# EAGLE design AudioUSB (EAGLE 9.4.0)
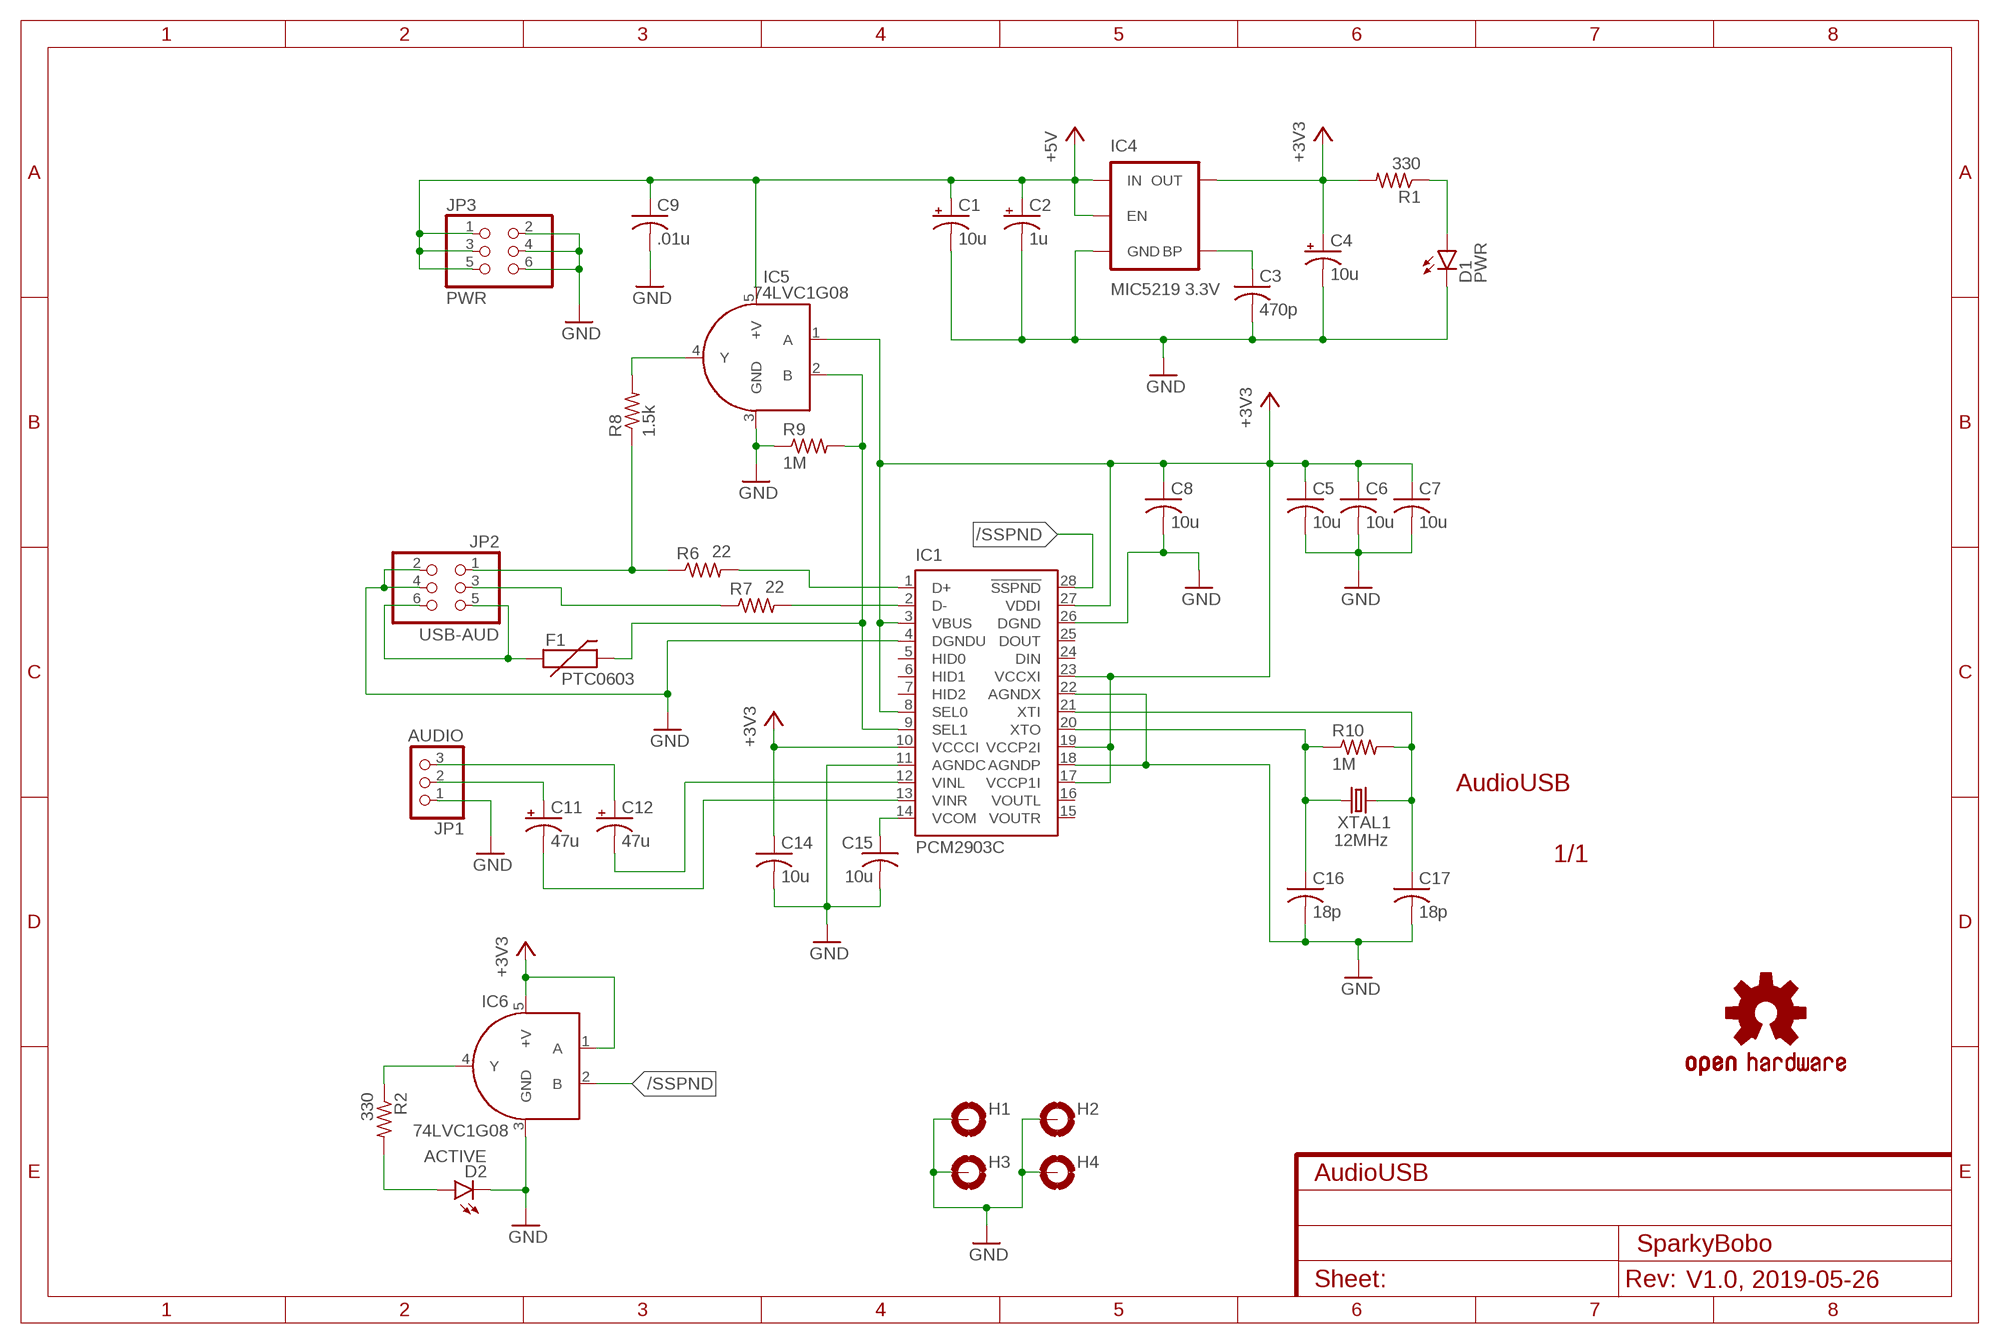
[diagram p0: schematic, sheet 1]
FRAME1 (FRAME-A4L): CNAME: AudioUSB; CREVISION: V1.0, 2019-05-26; DESIGNER: SparkyBobo

## Parts
C1  10u  CPOL-USB  [PANASONIC_B]
C2  1u  CPOL-USB  [PANASONIC_B]
C3  470p  C-USC0603  [C0603]
C4  10u  CPOL-USB  [PANASONIC_B]
C5  10u  C-USC0603  [C0603]
C6  10u  C-USC0603  [C0603]
C7  10u  C-USC0603  [C0603]
C8  10u  C-USC0603  [C0603]
C9  .01u  C-USC0603  [C0603]
C11  47u  CPOL-USD  [PANASONIC_D]
C12  47u  CPOL-USD  [PANASONIC_D]
C14  10u  C-USC0603  [C0603]
C15  10u  C-USC0603  [C0603]
C16  18p  C-USC0603  [C0603]
C17  18p  C-USC0603  [C0603]
D1  PWR  LED0603  [LED-0603]
D2  ACTIVE  LED0603  [LED-0603]
F1  PTC0603  [0603]
H1  MOUNT-PAD-ROUND2.8  [2,8-PAD]
H2  MOUNT-PAD-ROUND2.8  [2,8-PAD]
H3  MOUNT-PAD-ROUND2.8  [2,8-PAD]
H4  MOUNT-PAD-ROUND2.8  [2,8-PAD]
IC1  PCM2903C  [SSOP28]
IC4  MIC5219 3.3V  V_REG_MIC52193.3V  [SOT23-5]
IC5  74LVC1G08  SN74LVC1G08  [SOT23-5]
IC6  74LVC1G08  SN74LVC1G08  [SOT23-5]
JP1  AUDIO  PINHD-1X3  [1X03]
JP2  USB-AUD  PINHD-2X3  [2X03]
JP3  PWR  PINHD-2X3  [2X03]
LOGO1  OSHW-LOGOS  [OSHW-LOGO-S]
R1  330  R-US_R0603  [R0603]
R2  330  R-US_R0603  [R0603]
R6  22  R-US_R0603  [R0603]
R7  22  R-US_R0603  [R0603]
R8  1.5k  R-US_R0603  [R0603]
R9  1M  R-US_R0603  [R0603]
R10  1M  R-US_R0603  [R0603]
XTAL1  12MHz  CRYSTALHC49US  [HC49US]

## Nets
+3V3: C4.+ C5.1 C6.1 C7.1 C8.1 C14.1 IC1.3(VBUS) IC1.8(SEL0) IC1.10(VCCCI) IC1.17(VCCP1I) IC1.19(VCCP2I) IC1.23(VCCXI) IC1.27(VDDI) IC4.5(OUT) IC5.1(A) IC6.1(A) IC6.5(+V) R1.2
+5V: C1.+ C2.+ C9.1 IC4.1(IN) IC4.3(EN) IC5.5(+V) JP3.1 JP3.3 JP3.5
/SSPND: IC1.28(!SSPND) IC6.2(B)
GND: C1.- C2.- C3.2 C4.- C5.2 C6.2 C7.2 C8.2 C9.2 C14.2 C15.2 C16.2 C17.2 D1.C D2.C H1.B2,8(MOUNT) H2.B2,8(MOUNT) H3.B2,8(MOUNT) H4.B2,8(MOUNT) IC1.4(DGNDU) IC1.11(AGNDC) IC1.18(AGNDP) IC1.22(AGNDX) IC1.26(DGND) IC4.2(GND) IC5.3(GND) IC6.3(GND) JP1.1 JP2.2 JP2.4 JP3.2 JP3.4 JP3.6 R9.1
GND1: IC6.4(Y) R2.1
N$1: C12.- IC1.12(VINL)
N$2: C11.- IC1.13(VINR)
N$3: D1.A R1.1
N$5: C11.+ JP1.2
N$6: C12.+ JP1.3
N$7: IC5.4(Y) R8.2
N$8: JP2.3 R7.1
N$9: JP2.1 R6.1 R8.1
N$11: F1.1 JP2.5 JP2.6
N$24: C16.1 IC1.20(XTO) R10.1 XTAL1.1
N$25: IC1.1(D+) R6.2
N$26: C17.1 IC1.21(XTI) R10.2 XTAL1.2
N$27: IC1.2(D-) R7.2
N$30: D2.A R2.2
N$33: C3.1 IC4.4(BP)
N$34: C15.1 IC1.14(VCOM)
N$35: F1.2 IC1.9(SEL1) IC5.2(B) R9.2
Unconnected: IC1.5(HID0) IC1.6(HID1) IC1.7(HID2) IC1.15(VOUTR) IC1.16(VOUTL) IC1.24(DIN) IC1.25(DOUT)

## Library data of the parts
C1 C2 C4 C11 C12 = rcl:CPOL-US: POLARIZED CAPACITOR, American symbol
C3 C5-C9 C14-C17 = rcl:C-US: CAPACITOR, American symbol
D1 D2 = SparkFun-LED:LED: LEDs Standard schematic elements and footprints for 5mm, 3mm, 1206, and 0603 sized LEDs. 5mm - Spark Fun Electronics SKU : COM-00529 (and others)
F1 = SparkFun-PowerIC:PTC: Resettable Fuse PTC Resettable Fuse. Spark Fun Electronics SKU : COM-08357
H1-H4 = holes:MOUNT-PAD-ROUND: MOUNTING PAD, round
IC1 = CrazyGiraffe-AudioUSB:PCM2903C: The PCM2903C is TI's single-chip, USB, stereo audio codec with a USB-compliant full-speed protocol – SNR = 89 dB controller and S/PDIF.
IC4 = SparkFun-PowerIC:V_REG_MIC5219: V_REG MIC5219 Standard 3.3V and 5V 500mA LDO voltage regulator in SOT-23 layout. Micrel part MIC5219. BP (by-pass) pin is used to lower output noise with 470pF cap, may be left open.; PROD_ID: VREG-09872
IC5 IC6 = SparkFun-DigitalIC:SN74LVC1G08: Single-gate AND logic; PROD_ID: 10841
JP1 = pinhead:PINHD-1X3: PIN HEADER; DIGIKEY: ED10562-ND
JP2 JP3 = pinhead:PINHD-2X3: PIN HEADER
LOGO1 = SparkFun-Aesthetics:OSHW-LOGO: Open Source Hardware Logo This logo indicates the piece of hardware it is found on incorporates a OSHW license and/or adheres to the definition of open source hardware found here: http://freedomdefined.org/OSHW
R1 R2 R6-R10 = rcl:R-US_: RESISTOR, American symbol
XTAL1 = SparkFun-FreqCtrl:CRYSTAL: Various standard crystals. Proven footprints.

## Net classes
0 default: width 0.152 mm

## Board
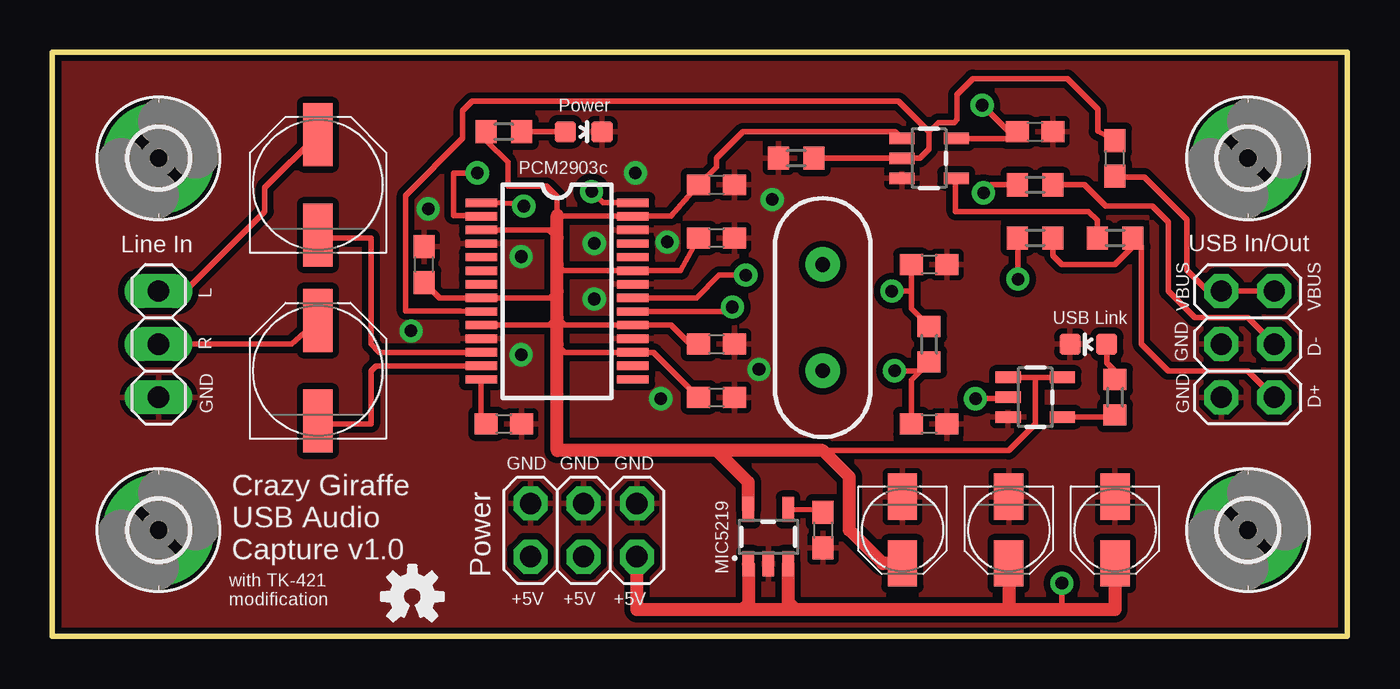
[diagram p1: board, top side]
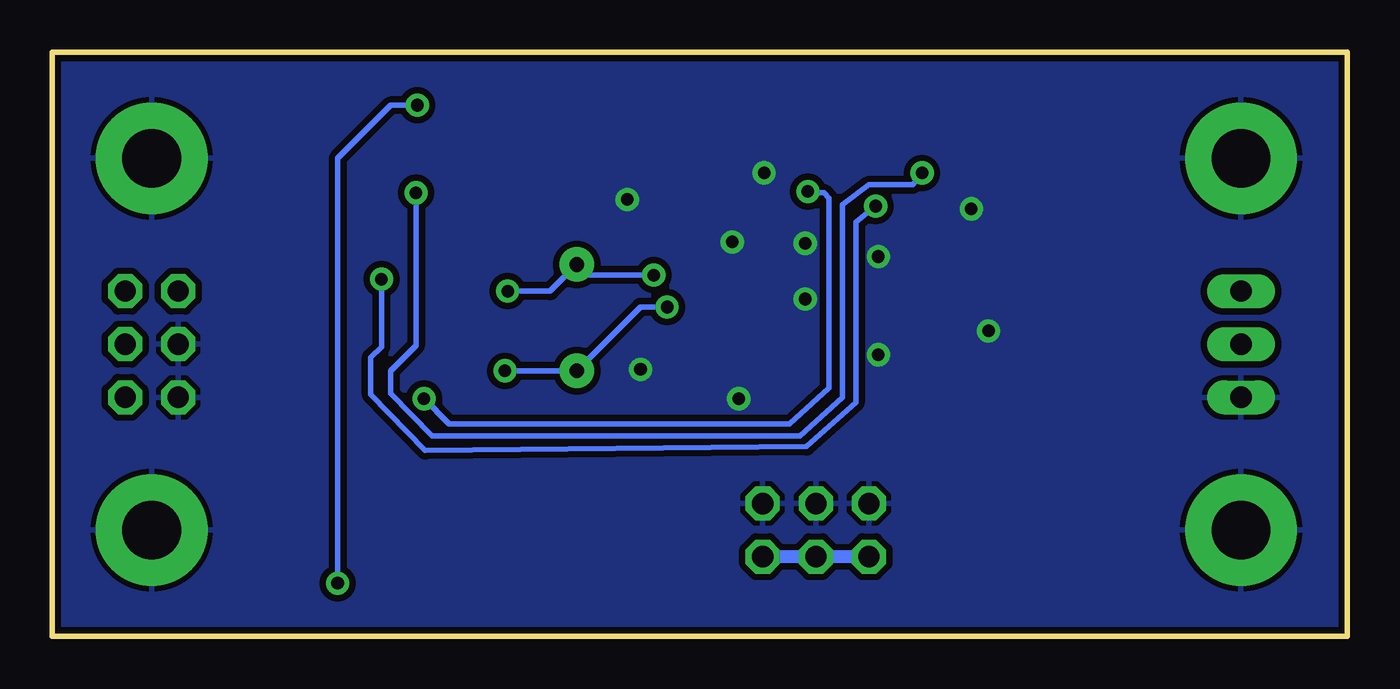
[diagram p2: board, bottom side, seen from below]

Size 61.9 x 27.93 mm. Coordinates in mm from the lower left corner, seen from the top.
Outline: 0,0 61.9,0 61.9,27.93 0,27.93 0,0
Copper layers (1*16): Top 0.035mm / dielectric 1.5mm / Bottom 0.035mm
Design rules "SparkFun": minimum track width 8mil, minimum drill 20mil, track to track 8mil, track to pad 8mil, pad to pad 8mil, via to via 8mil, smd to smd 8mil, copper to edge 10mil, drill to drill 8mil, minimum pad ring 12mil, minimum via ring 10mil, stop-mask expansion 4mil, vias tented up to drill 25mil, thermal gap 10mil

### Footprints (pad centres in the part's own frame; a part is rotated, then mirrored left to right if it is on the bottom)
PANASONIC_B = smd 2.2 x 1.4: + 1.6,0; - -1.6,0
C0603 = smd 1.1 x 1: 1 -0.85,0; 2 0.85,0
PANASONIC_D = smd 3 x 1.4: + 2.4,0; - -2.4,0
LED-0603 = smd 1 x 1: A 0,-0.877; C 0,0.877
0603 = smd 1.1 x 1: 1 -0.85,0; 2 0.85,0
2,8-PAD = drill 2.8 pad 5.334: B2,8 0,0
SSOP28 = smd 0.4 x 1.5: 1 -4.225,-3.625; 2 -3.575,-3.625; 3 -2.925,-3.625; 4 -2.275,-3.625; 5 -1.625,-3.625; 6 -0.975,-3.625; 7 -0.325,-3.625; 8 0.325,-3.625; 9 0.975,-3.625; 10 1.625,-3.625; 11 2.275,-3.625; 12 2.925,-3.625; 13 3.575,-3.625; 14 4.225,-3.625; 15 4.225,3.625; 16 3.575,3.625; 17 2.925,3.625; 18 2.275,3.625; 19 1.625,3.625; 20 0.975,3.625; 21 0.325,3.625; 22 -0.325,3.625; 23 -0.975,3.625; 24 -1.625,3.625; 25 -2.275,3.625; 26 -2.925,3.625; 27 -3.575,3.625; 28 -4.225,3.625
SOT23-5 = smd 0.55 x 1.2: 1 -0.95,-1.3; 2 0,-1.3; 3 0.95,-1.3; 4 0.95,1.3; 5 -0.95,1.3
1X03 = drill 1.016 long: 1 -2.54,0; 2 0,0; 3 2.54,0
2X03 = drill 1.016 octagon: 1 -2.54,-1.27; 2 -2.54,1.27; 3 0,-1.27; 4 0,1.27; 5 2.54,-1.27; 6 2.54,1.27
R0603 = smd 1 x 1.1: 1 -0.85,0; 2 0.85,0
HC49US = drill 0.7 pad 1.651: 1 -2.54,0; 2 2.54,0

### Placement (x,y rotation side)
C1  45.72,5.08 270 top
C2  50.8,5.08 270 top
C3  36.83,5.08 270 top
C4  40.64,5.08 270 top
C5  31.75,19.05 0 top
C6  31.75,13.97 0 top
C7  31.75,11.43 0 top
C8  31.75,21.59 0 top
C9  46.99,24.13 0 top
C11  12.7,12.7 90 top
C12  12.7,21.59 90 top
C14  17.78,17.78 90 top
C15  21.59,10.16 0 top
C16  41.91,10.16 0 top
C17  41.91,17.78 0 top
D1  25.4,24.13 270 top
D2  49.53,13.97 90 top
F1  50.8,22.86 90 top
H1  5.08,22.86 0 top
H2  57.15,22.86 0 top
H3  57.15,5.08 0 top
H4  5.08,5.08 0 top
IC1  24.13,16.51 270 top
IC4  34.23,4.76 0 top
IC5  41.91,22.86 270 top
IC6  46.99,11.43 270 top
JP1  5.08,13.97 90 top
JP2  57.15,13.97 90 top
JP3  25.4,5.08 0 top
LOGO1  17.21,1.91 0 top
R1  21.59,24.13 180 top
R2  50.8,11.43 90 top
R6  46.99,19.05 180 top
R7  46.99,21.59 180 top
R8  50.8,19.05 180 top
R9  35.56,22.86 0 top
R10  41.91,13.97 90 top
XTAL1  36.83,15.24 90 top

### Tracks (layer width: path | path; a pad name or v marks a point on that pad's centre or on a via)
+3V3
  Top 0.254: IC6.5 IC6.1 46.04,12.38 46.99,12.38 46.99,10.16 45.72,8.89 36.83,8.89 | C6.1 30.48,13.97 29.57,14.88 IC1.19 24.48,14.88 24.13,15.24 23.77,14.88 IC1.10 | C7.1 28.75,13.59 IC1.17 24.52,13.59 24.13,13.97 | C5.1 30.03,17.48 IC1.23 24.43,17.48 24.13,17.78 | IC1.3 23.75,19.43 24.13,19.05 | 24.13,16.51 23.8,16.18 IC1.8 18.52,16.18 C14.1 | 24.22,20.11 24.36,20.09 IC1.27 29.59,20.09 C8.1 31.75,22.44 31.75,22.86 33.02,24.13 40.29,24.13 IC5.1 | 24.22,20.11 24.13,20.13 | R1.2 20.74,23.71 21.78,22.67 21.78,21.53 23.62,21.53 24.13,21.02 24.13,20.2 24.22,20.11
  Top 0.61: 24.13,20.13 24.13,19.05 24.13,17.78 24.13,16.51 24.13,15.24 24.13,13.97 24.13,8.89 31.75,8.89 | IC4.5 33.28,7.36 31.75,8.89 | C4.+ 39.7,3.48 38.1,5.08 38.1,7.62 36.83,8.89 31.75,8.89
+5V  (via drill 0.6)
  Top 0.254: IC5.5 45.82,23.81 | 45.82,23.81 C9.1 | 45.82,23.81 45.82,24.03 v44.45,25.4 | v48.26,2.54 48.26,1.27
  Top 0.61: C2.+ 50.8,1.27 48.26,1.27 45.72,1.27 | 45.72,1.27 35.56,1.27 | 35.56,1.27 32.96,1.27 | 32.96,1.27 27.94,1.27 JP3.5 | IC4.1 33.28,1.53 32.96,1.27 | IC4.3 35.18,1.65 35.56,1.27 | C1.+ 45.72,1.27
  Bottom 0.254: v44.45,25.4 45.72,25.4 48.26,22.86 v48.26,2.54
  Bottom 0.61: JP3.5 JP3.3 JP3.1
/SSPND  (via drill 0.6)
  Top 0.254: IC1.28 26.32,20.73 v25.78,21.27 | v44.13,11.37 45.63,11.37 IC6.2
  Bottom 0.254: v44.13,11.37 42.93,10.16 26.67,10.16 24.77,11.87 24.77,20.95 25.02,21.21 25.72,21.21 v25.78,21.27
GND  (via drill 0.6)
  Top 0.254: 20.52,14.22 IC1.11 | 32.77,21.65 32.7,21.59
  other vias: 22.42,18.16 22.42,13.46 33.78,12.76 34.42,20.89 29.4,18.86 25.91,18.8 25.91,16.13 29.08,11.37 27.88,22.16 17.14,14.61 17.97,20.45
  pour Top (isolate 0.305): 0,27.94 62.23,27.94 62.23,0 0,0
  pour Bottom (isolate 0.305): 0,27.94 62.23,27.94 62.23,0 0,0
GND1
  Top 0.254: IC6.4 50.7,10.48 R2.1
N$1
  Top 0.254: IC1.12 15.62,13.59 15.24,13.97 15.24,19.05 12.84,19.05 C12.-
N$2
  Top 0.254: IC1.13 15.47,12.94 15.24,12.7 15.24,10.16 12.84,10.16 C11.-
N$3
  Top 0.254: D1.A R1.1
N$5
  Top 0.254: JP1.2 11.43,13.97 C11.+
N$6
  Top 0.254: JP1.3 6.35,16.51 10.16,20.32 10.16,21.45 C12.+
N$7
  Top 0.254: R8.2 49.95,19.9 49.53,20.32 43.18,20.32 43.18,21.88 IC5.4
N$8
  Top 0.254: JP2.3 57.15,15.24 54.61,15.24 53.34,16.51 53.34,19.81 52.58,20.57 50.35,20.57 49.34,21.59 R7.1
N$9
  Top 0.254: R6.1 47.84,18.2 48.26,17.78 50.8,17.78 51.65,18.63 R8.1 52.07,18.63 52.07,13.97 53.34,12.7 57.15,12.7 JP2.1
N$11
  Top 0.254: JP2.5 JP2.6 55.24,16.51 54.23,17.53 54.23,19.94 52.2,21.97 50.84,21.97 F1.1
N$24  (via drill 0.6)
  Top 0.254: C16.1 41.06,12.27 R10.1 41.49,12.7 v40.26,12.7 | IC1.20 32.3,15.54 v32.51,15.75
  Bottom 0.254: v40.26,12.7 XTAL1.1 33.78,15.75 v32.51,15.75
N$25  (via drill 0.6)
  Top 0.254: v46.16,17.08 46.16,19.03 R6.2 | v22.54,20.57 22.35,20.7 IC1.1
  Bottom 0.254: v46.16,17.08 46.16,13.84 46.67,13.34 46.67,11.56 44.07,8.89 25.84,9.08 23.5,11.18 23.5,19.81 v22.54,20.57
N$26  (via drill 0.6)
  Top 0.254: C17.1 41.06,16.51 | 41.06,16.51 41.06,15.67 R10.2 | v40.13,16.51 41.06,16.51 | IC1.21 30.79,16.18 31.88,17.27 v33.15,17.27
  Bottom 0.254: v40.13,16.51 38.1,16.51 XTAL1.2 36.32,17.27 v33.15,17.27
N$27  (via drill 0.6)
  Top 0.254: R7.2 44.9,21.59 v44.51,21.21 | IC1.2 20.55,20.13 19.18,20.13 19.18,22.16 v20.32,22.16
  Bottom 0.254: v44.51,21.21 44.51,13.91 45.72,12.7 45.72,11.62 43.75,9.59 26.16,9.59 24.13,11.43 24.13,20.64 22.86,21.59 20.77,21.59 v20.32,22.16
N$30
  Top 0.254: R2.2 50.8,12.7 50.42,13.08 D2.A
N$33
  Top 0.254: C3.1 36.57,6.06 IC4.4
N$34
  Top 0.254: IC1.14 20.5,10.39 C15.1
N$35
  Top 0.254: R9.2 36.41,23.28 36.83,22.86 IC5.2 41.47,22.86 41.91,23.3 41.91,24.13 | IC1.9 19.49,15.56 16.89,15.56 16.89,21.08 19.62,23.81 19.62,25.15 20.07,25.59 40.45,25.59 41.91,24.13 | F1.2 49.97,24.15 49.97,25.21 48.51,26.67 44.01,26.67 43.24,25.91 43.24,24.7 43.12,24.57 42.35,24.57 41.91,24.13

### Text on the board
tPlace: Power | PCM2903c | Line In | USB In/Out | L | VBUS | VBUS | USB Link | R | GND | D- | GND | GND | D+ | GND | GND | GND | Power | Crazy Giraffe / USB Audio / Capture v1.0 | MIC5219 | +5V | +5V | +5V | with TK-421 / modification